# EAGLE design ToolPCB (EAGLE 9.4.2)
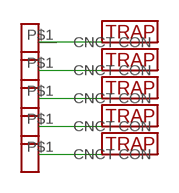
[diagram p0: schematic, sheet 1]

## Parts
U$1  MOLEX-LITE-TRAP  [MOLEX-LITE-TRAP]
U$2  MOLEX-LITE-TRAP  [MOLEX-LITE-TRAP]
U$3  MOLEX-LITE-TRAP  [MOLEX-LITE-TRAP]
U$4  MOLEX-LITE-TRAP  [MOLEX-LITE-TRAP]
U$5  MOLEX-LITE-TRAP  [MOLEX-LITE-TRAP]
U$6  B_CONTACT  [B_CONTACT]
U$7  B_CONTACT  [B_CONTACT]
U$8  B_CONTACT  [B_CONTACT]
U$9  B_CONTACT  [B_CONTACT]
U$10  B_CONTACT  [B_CONTACT]

## Nets
N$1: U$3.TRAP(CON) U$6.P$1(CNCT)
N$2: U$2.TRAP(CON) U$7.P$1(CNCT)
N$3: U$1.TRAP(CON) U$8.P$1(CNCT)
N$4: U$4.TRAP(CON) U$9.P$1(CNCT)
N$5: U$5.TRAP(CON) U$10.P$1(CNCT)

## Library data of the parts
U$1-U$5 = MolexLiteTrap:MOLEX-LITE-TRAP
U$6-U$10 = MolexLiteTrap:B_CONTACT

## Board
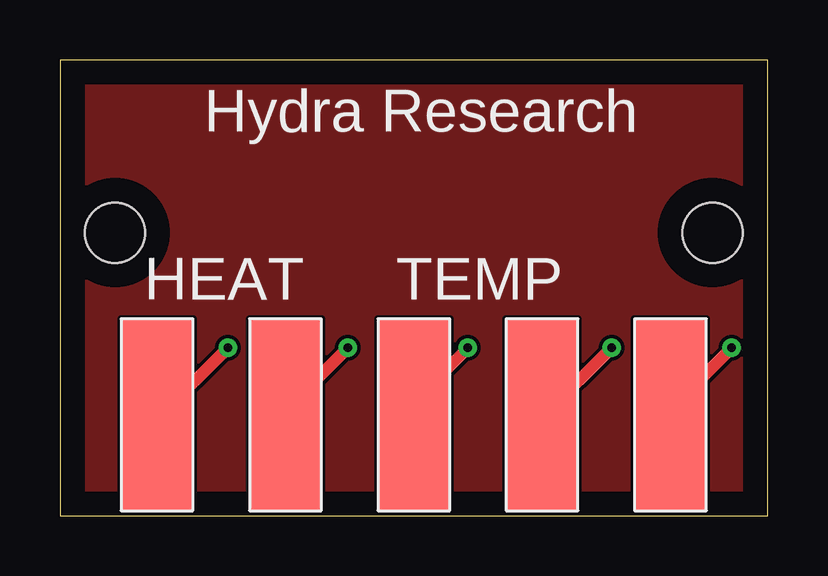
[diagram p1: board, top side]
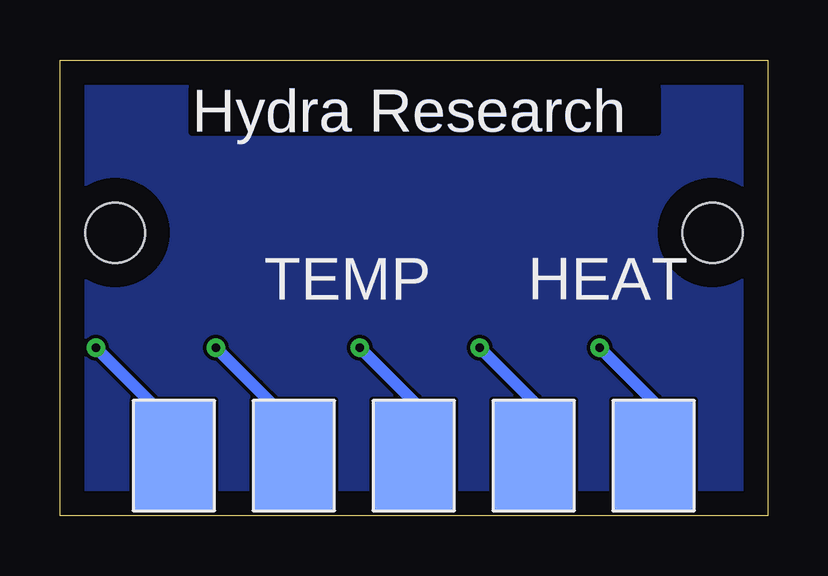
[diagram p2: board, bottom side, seen from below]

Size 29.5 x 19 mm. Coordinates in mm from the lower left corner, seen from the top.
Outline: 0,0 29.5,0 29.5,19 0,19 0,0
Copper layers (1*16): Top 0.035mm / dielectric 1.5mm / Bottom 0.035mm
Design rules "default": minimum track width 6mil, minimum drill 0.35mm, track to track 6mil, track to pad 6mil, pad to pad 6mil, via to via 6mil, smd to smd 6mil, copper to edge 40mil, drill to drill 6mil, minimum pad ring 10mil, minimum via ring 8mil, stop-mask expansion 4mil, vias tented up to drill 0mil, thermal gap 10mil
Holes 2.5 mm at 2.3,11.8 27.2,11.8

### Footprints (pad centres in the part's own frame; a part is rotated, then mirrored left to right if it is on the bottom)
MOLEX-LITE-TRAP = smd 8 x 3: TRAP 4,1.5
B_CONTACT = smd 4.6 x 3.4: P$1 2.3,1.7

### Placement (x,y rotation side)
U$1  26.95,0.2 90 top
U$2  5.55,0.2 90 top
U$3  21.6,0.2 90 top
U$4  10.9,0.2 90 top
U$5  16.25,0.2 90 top
U$6  18.05,0.2 90 bottom
U$7  3.05,0.2 90 bottom
U$8  23.05,0.2 90 bottom
U$9  8.05,0.2 90 bottom
U$10  13.05,0.2 90 bottom

### Tracks (layer width: path | path; a pad name or v marks a point on that pad's centre or on a via)
CNCT
  pour Bottom: 0,0 0,19 30,19 30,0
CON
  pour Top: 0,-1 29,-1 29,19 0,19
N$1  (via drill 0.35)
  Top 0.5: v23,7 20.2,4.2 U$3.TRAP
  Bottom 0.5: U$6.P$1 19.75,3.75 v23,7
N$2  (via drill 0.35)
  Top 0.5: v7,7 4.2,4.2 U$2.TRAP
  Bottom 0.5: U$7.P$1 4.75,4.75 v7,7
N$3  (via drill 0.35)
  Top 0.5: U$1.TRAP 25.45,4.45 v28,7
  Bottom 0.5: U$8.P$1 24.75,3.75 v28,7
N$4  (via drill 0.35)
  Top 0.5: U$4.TRAP 9.4,4.4 v12,7
  Bottom 0.5: U$9.P$1 9.75,4.75 v12,7
N$5  (via drill 0.35)
  Top 0.5: v17,7 14.75,4.75 U$5.TRAP
  Bottom 0.5: U$10.P$1 14.75,4.75 v17,7

### Text on the board
Bottom: Hydra Research
tPlace: Hydra Research
bPlace: Hydra Research | HEAT | TEMP
tNames: HEAT | TEMP